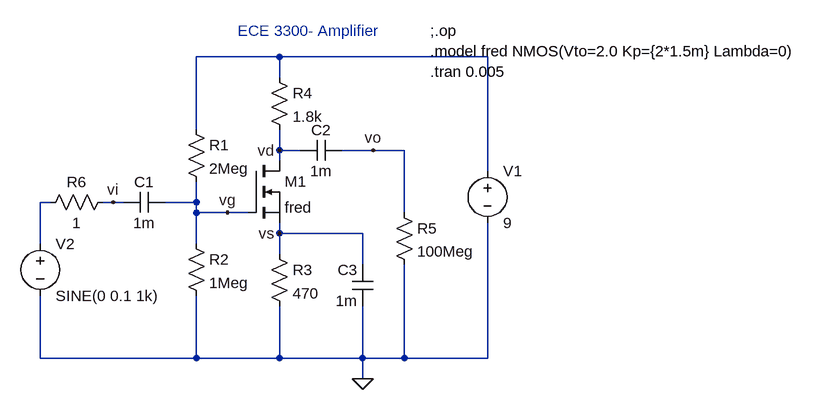
[diagram p0: schematic ECE3300_Amplifier_with_AC.asc]
ECE3300_Amplifier_with_AC.asc, the LTspice schematic file:
Version 4
SHEET 1 1072 680
WIRE 208 -48 80 -48
WIRE 528 -48 208 -48
WIRE 208 -16 208 -48
WIRE 80 64 80 -48
WIRE 208 96 208 64
WIRE 240 96 208 96
WIRE 352 96 304 96
WIRE 400 96 352 96
WIRE 208 112 208 96
WIRE 528 128 528 -48
WIRE -144 176 -160 176
WIRE -48 176 -64 176
WIRE -32 176 -48 176
WIRE 80 176 80 144
WIRE 80 176 32 176
WIRE 80 192 80 176
WIRE 128 192 80 192
WIRE 160 192 128 192
WIRE 400 192 400 96
WIRE 208 224 208 208
WIRE 336 224 208 224
WIRE -160 240 -160 176
WIRE 80 240 80 192
WIRE 208 256 208 224
WIRE 336 272 336 224
WIRE -160 416 -160 320
WIRE 80 416 80 320
WIRE 80 416 -160 416
WIRE 208 416 208 336
WIRE 208 416 80 416
WIRE 336 416 336 336
WIRE 336 416 208 416
WIRE 400 416 400 272
WIRE 400 416 336 416
WIRE 528 416 528 208
WIRE 528 416 400 416
WIRE 336 448 336 416
FLAG 336 448 0
FLAG -48 176 vi
FLAG 352 96 vo
FLAG 208 96 vd
FLAG 208 224 vs
FLAG 128 192 vg
SYMBOL res 64 48 R0
SYMATTR InstName R1
SYMATTR Value 2Meg
SYMBOL res 64 224 R0
SYMATTR InstName R2
SYMATTR Value 1Meg
SYMBOL res 192 240 R0
SYMATTR InstName R3
SYMATTR Value 470
SYMBOL res 192 -32 R0
SYMATTR InstName R4
SYMATTR Value 1.8k
SYMBOL nmos 160 112 R0
SYMATTR InstName M1
SYMATTR Value fred
SYMBOL voltage 528 112 R0
WINDOW 123 0 0 Left 0
WINDOW 39 0 0 Left 0
SYMATTR InstName V1
SYMATTR Value 9
SYMBOL cap 32 160 R90
WINDOW 0 0 32 VBottom 2
WINDOW 3 32 32 VTop 2
SYMATTR InstName C1
SYMATTR Value 1m
SYMBOL cap 304 80 R90
WINDOW 0 0 32 VBottom 2
WINDOW 3 32 32 VTop 2
SYMATTR InstName C2
SYMATTR Value 1m
SYMBOL cap 352 336 R180
WINDOW 0 24 56 Left 2
WINDOW 3 24 8 Left 2
SYMATTR InstName C3
SYMATTR Value 1m
SYMBOL res 384 176 R0
SYMATTR InstName R5
SYMATTR Value 100Meg
SYMBOL voltage -160 224 R0
WINDOW 123 0 0 Left 0
WINDOW 39 0 0 Left 0
SYMATTR InstName V2
SYMATTR Value SINE(0 0.1 1k)
SYMBOL res -48 160 R90
WINDOW 0 0 56 VBottom 2
WINDOW 3 32 56 VTop 2
SYMATTR InstName R6
SYMATTR Value 1
TEXT 144 -88 Left 2 ;ECE 3300- Amplifier
TEXT 440 -88 Left 2 !;.op\n.model fred NMOS(Vto=2.0 Kp={2*1.5m} Lambda=0)\n.tran 0.005

The netlist it stands for:
* ECE3300_Amplifier_with_AC.asc
R1 N001 vg 2Meg
R2 vg 0 1Meg
R3 vs 0 470
R4 N001 vd 1.8k
M1 vd vg vs vs fred
V1 N001 0 9
C1 vg vi 1m
C2 vo vd 1m
C3 0 vs 1m
R5 vo 0 100Meg
V2 N002 0 SINE(0 0.1 1k)
R6 vi N002 1
.model NMOS NMOS
.model PMOS PMOS
.lib standard.mos
* ECE 3300- Amplifier
;.op
.model fred NMOS(Vto=2.0 Kp={2*1.5m} Lambda=0)
.tran 0.005
.backanno
.end